# EAGLE schematic candy-avb (EAGLE 9.2.2)

## Sheet 1 of 4
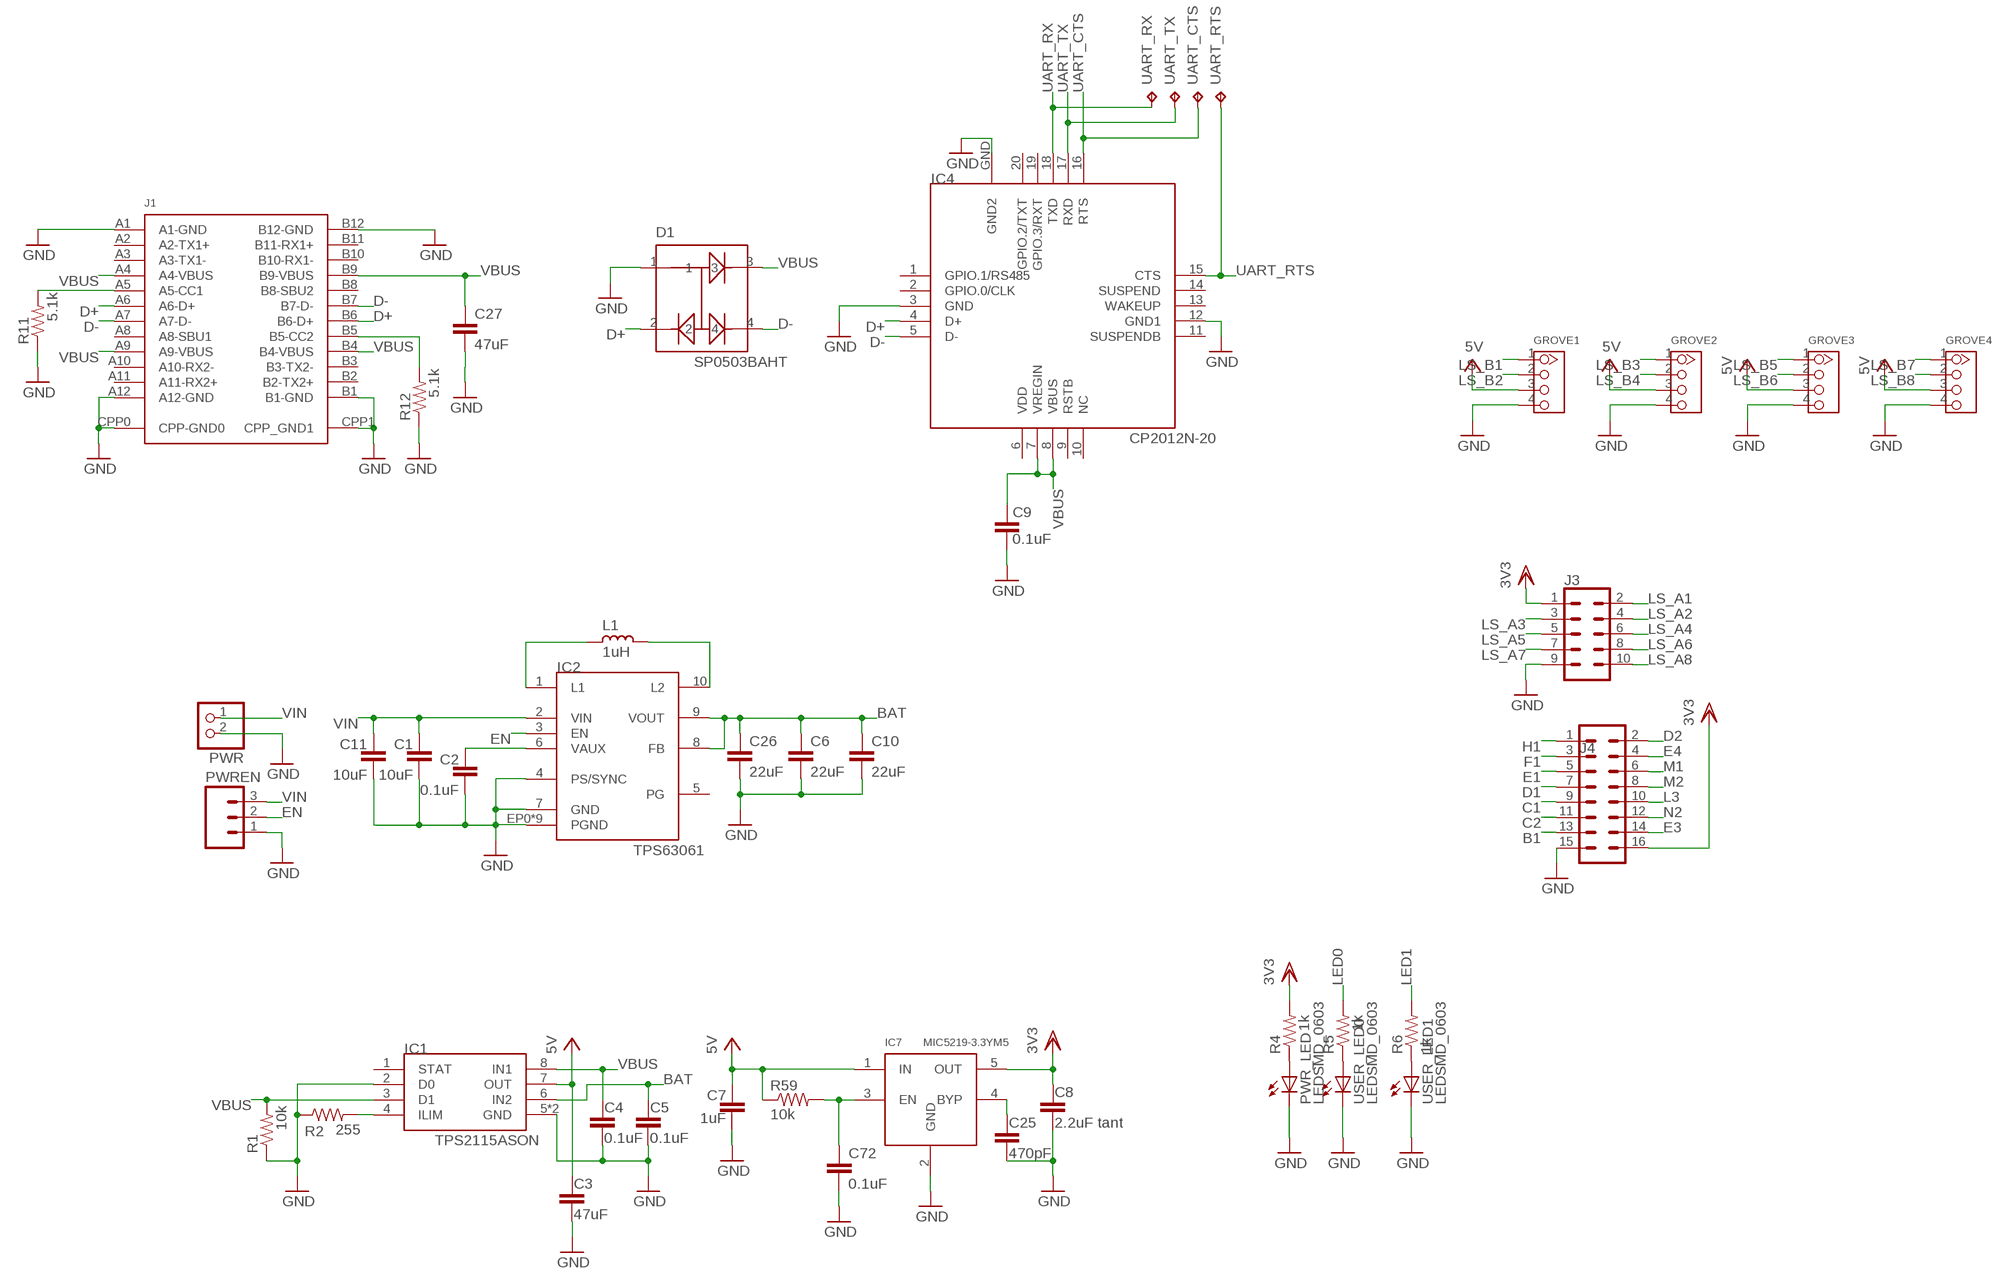
[diagram p0: schematic, sheet 1]

### Parts
C1  10uF  C-EUC0805  [C0805]
C2  0.1uF  C-EUC1608  [C1608]
C3  47uF  C-EUC1210  [C1210]
C4  0.1uF  C-EUC1608  [C1608]
C5  0.1uF  C-EUC1608  [C1608]
C6  22uF  C-EUC0805  [C0805]
C7  1uF  C-EUC1608  [C1608]
C8  2.2uF tant  C-EUC1608  [C1608]
C9  0.1uF  C-EUC1608  [C1608]
C10  22uF  C-EUC0805  [C0805]
C11  10uF  C-EUC0805  [C0805]
C25  470pF  C-EUC1608  [C1608]
C26  22uF  C-EUC0805  [C0805]
C27  47uF  C-EUC1210  [C1210]
C72  0.1uF  C-EUC1608  [C1608]
D1  SP0503BAHT  [SOT143]
GROVE1  4P-2.0  SEEED_GROVE_CONN_4PSMD  [SEEED_GROVE_4PIN_TH]
GROVE2  4P-2.0  SEEED_GROVE_CONN_4PSMD  [SEEED_GROVE_4PIN_TH]
GROVE3  4P-2.0  SEEED_GROVE_CONN_4PSMD  [SEEED_GROVE_4PIN_TH]
GROVE4  4P-2.0  SEEED_GROVE_CONN_4PSMD  [SEEED_GROVE_4PIN_TH]
IC1  TPS2115ASON  [SON8]
IC2  TPS63061  TPS6306X  [S-PDSO-N10]
IC4  CP2012N-20  [CP2102-QFN20]
IC7  MIC5219-3.3YM5  [SOT23-5]
J1  USB_TYPEC_WE_632723  [USB_TYPEC_WE_632723]
J3  CONN_05X2PTH  [2X5]
J4  2X6 FEMALE  CONN_08X2  [2X8]
L1  1uH  L_4240  [L4240]
PWR  JST_2PIN-THM  [JST-PH-2-THM]
PWR_LED  LEDSMD_0603  [CHIPLED_0603]
PWREN  M03PTH  [1X03]
R1  10k  RESISTOR0402-RES  [0402-RES]
R2  255  RESISTOR0402-RES  [0402-RES]
R4  1k  RESISTOR0402-RES  [0402-RES]
R5  1k  RESISTOR0402-RES  [0402-RES]
R6  1k  RESISTOR0402-RES  [0402-RES]
R11  5.1k  RESISTOR0402-RES  [0402-RES]
R12  5.1k  RESISTOR0402-RES  [0402-RES]
R59  10k  RESISTOR0402-RES  [0402-RES]
UART_CTS  TPB1,27  [B1,27]
UART_RTS  TPB1,27  [B1,27]
UART_RX  TPB1,27  [B1,27]
UART_TX  TPB1,27  [B1,27]
USER_LED0  LEDSMD_0603  [CHIPLED_0603]
USER_LED1  LEDSMD_0603  [CHIPLED_0603]

### Nets
B1: J4.13 ; also sheet 2
BAT: C5.1 C6.1 C10.1 C26.1 IC1.6(IN2) IC2.8(FB) IC2.9(VOUT)
C1: J4.9 ; also sheet 2
C2: J4.11 ; also sheet 2
D1: J4.7 ; also sheet 2
D2: J4.2 ; also sheet 2
D+: D1.2 IC4.4(D+) J1.A6(A6-D+) J1.B6(B6-D+)
D-: D1.4 IC4.5(D-) J1.A7(A7-D-) J1.B7(B7-D-)
E1: J4.5 ; also sheet 2
E3: J4.14 ; also sheet 2
E4: J4.4 ; also sheet 2
EN: IC2.3(EN) PWREN.2
EN1: C72.1 IC7.3(EN) R59.2
F1: J4.3 ; also sheet 2
GND: C1.2 C2.2 C3.2 C4.2 C5.2 C6.2 C7.2 C8.2 C9.2 C10.2 C11.2 C25.2 C26.2 C27.2 C72.2 D1.1 GROVE1.4 GROVE2.4 GROVE3.4 GROVE4.4 IC1.2(D0) IC1.5(GND) IC1.EP(GND) IC2.4(PS/SYNC) IC2.7(GND) IC2.EP0(PGND) IC2.EP1(PGND) IC2.EP2(PGND) IC2.EP3(PGND) IC2.EP4(PGND) IC2.EP5(PGND) IC2.EP6(PGND) IC2.EP7(PGND) IC2.EP8(PGND) IC4.3(GND) IC4.12(GND1) IC4.GND(GND2) IC7.2(GND) J1.A1(A1-GND) J1.A12(A12-GND) J1.B1(B1-GND) J1.B12(B12-GND) J1.CPP0(CPP-GND0) J1.CPP1(CPP_GND1) J3.9 J4.15 PWR.2 PWR_LED.C PWREN.1 R1.1 R2.1 R11.1 R12.1 USER_LED0.C USER_LED1.C ; also sheet 2,3,4
H1: J4.1 ; also sheet 2
L3: J4.10 ; also sheet 2
LED0: R5.2 ; also sheet 2
LED1: R6.2 ; also sheet 2
LS_A1: J3.2 ; also sheet 2
LS_A2: J3.4 ; also sheet 2
LS_A3: J3.3 ; also sheet 2
LS_A4: J3.6 ; also sheet 2
LS_A5: J3.5 ; also sheet 2
LS_A6: J3.8 ; also sheet 2
LS_A7: J3.7 ; also sheet 2
LS_A8: J3.10 ; also sheet 2
LS_B1: GROVE1.1 ; also sheet 2
LS_B2: GROVE1.2 ; also sheet 2
LS_B3: GROVE2.1 ; also sheet 2
LS_B4: GROVE2.2 ; also sheet 2
LS_B5: GROVE3.1 ; also sheet 2
LS_B6: GROVE3.2 ; also sheet 2
LS_B7: GROVE4.1 ; also sheet 2
LS_B8: GROVE4.2 ; also sheet 2
M1: J4.6 ; also sheet 2
M2: J4.8 ; also sheet 2
N2: J4.12 ; also sheet 2
N$1: C2.1 IC2.6(VAUX)
N$2: C25.1 IC7.4(BYP)
N$3: PWR_LED.A R4.1
N$4: J1.A5(A5-CC1) R11.2
N$5: IC2.1(L1) L1.2
N$6: IC2.10(L2) L1.1
N$7: J1.B5(B5-CC2) R12.2
N$9: R6.1 USER_LED1.A
N$19: R5.1 USER_LED0.A
N$61: IC1.4(ILIM) R2.2
UART_CTS: IC4.16(RTS) UART_CTS.TP ; also sheet 2
UART_RTS: IC4.15(CTS) UART_RTS.TP ; also sheet 2
UART_RX: IC4.18(TXD) UART_RX.TP ; also sheet 2
UART_TX: IC4.17(RXD) UART_TX.TP ; also sheet 2
VBUS: C4.1 C9.1 C27.1 D1.3 IC1.3(D1) IC1.8(IN1) IC4.7(VREGIN) IC4.8(VBUS) J1.A4(A4-VBUS) J1.A9(A9-VBUS) J1.B4(B4-VBUS) J1.B9(B9-VBUS) R1.2
VCC: C3.1 C7.1 GROVE1.3 GROVE2.3 GROVE3.3 GROVE4.3 IC1.7(OUT) IC7.1(IN) R59.1 ; supply symbol labelled 5V ; also sheet 2
VDD: C8.1 IC7.5(OUT) J3.1 J4.16 R4.2 ; supply symbol labelled 3V3 ; also sheet 2,3,4
VIN: C1.1 C11.1 IC2.2(VIN) PWR.1 PWREN.3
Unconnected: IC1.1(STAT) IC2.5(PG) IC4.1(GPIO.1/RS485) IC4.2(GPIO.0/CLK) IC4.9(RSTB) IC4.10(NC) IC4.11(SUSPENDB) IC4.13(WAKEUP) IC4.14(SUSPEND) IC4.19(GPIO.3/RXT) IC4.20(GPIO.2/TXT) J1.A2(A2-TX1+) J1.A3(A3-TX1-) J1.A8(A8-SBU1) J1.A10(A10-RX2-) J1.A11(A11-RX2+) J1.B2(B2-TX2+) J1.B3(B3-TX2-) J1.B8(B8-SBU2) J1.B10(B10-RX1-) J1.B11(B11-RX1+)

## Sheet 2 of 4: FPGA
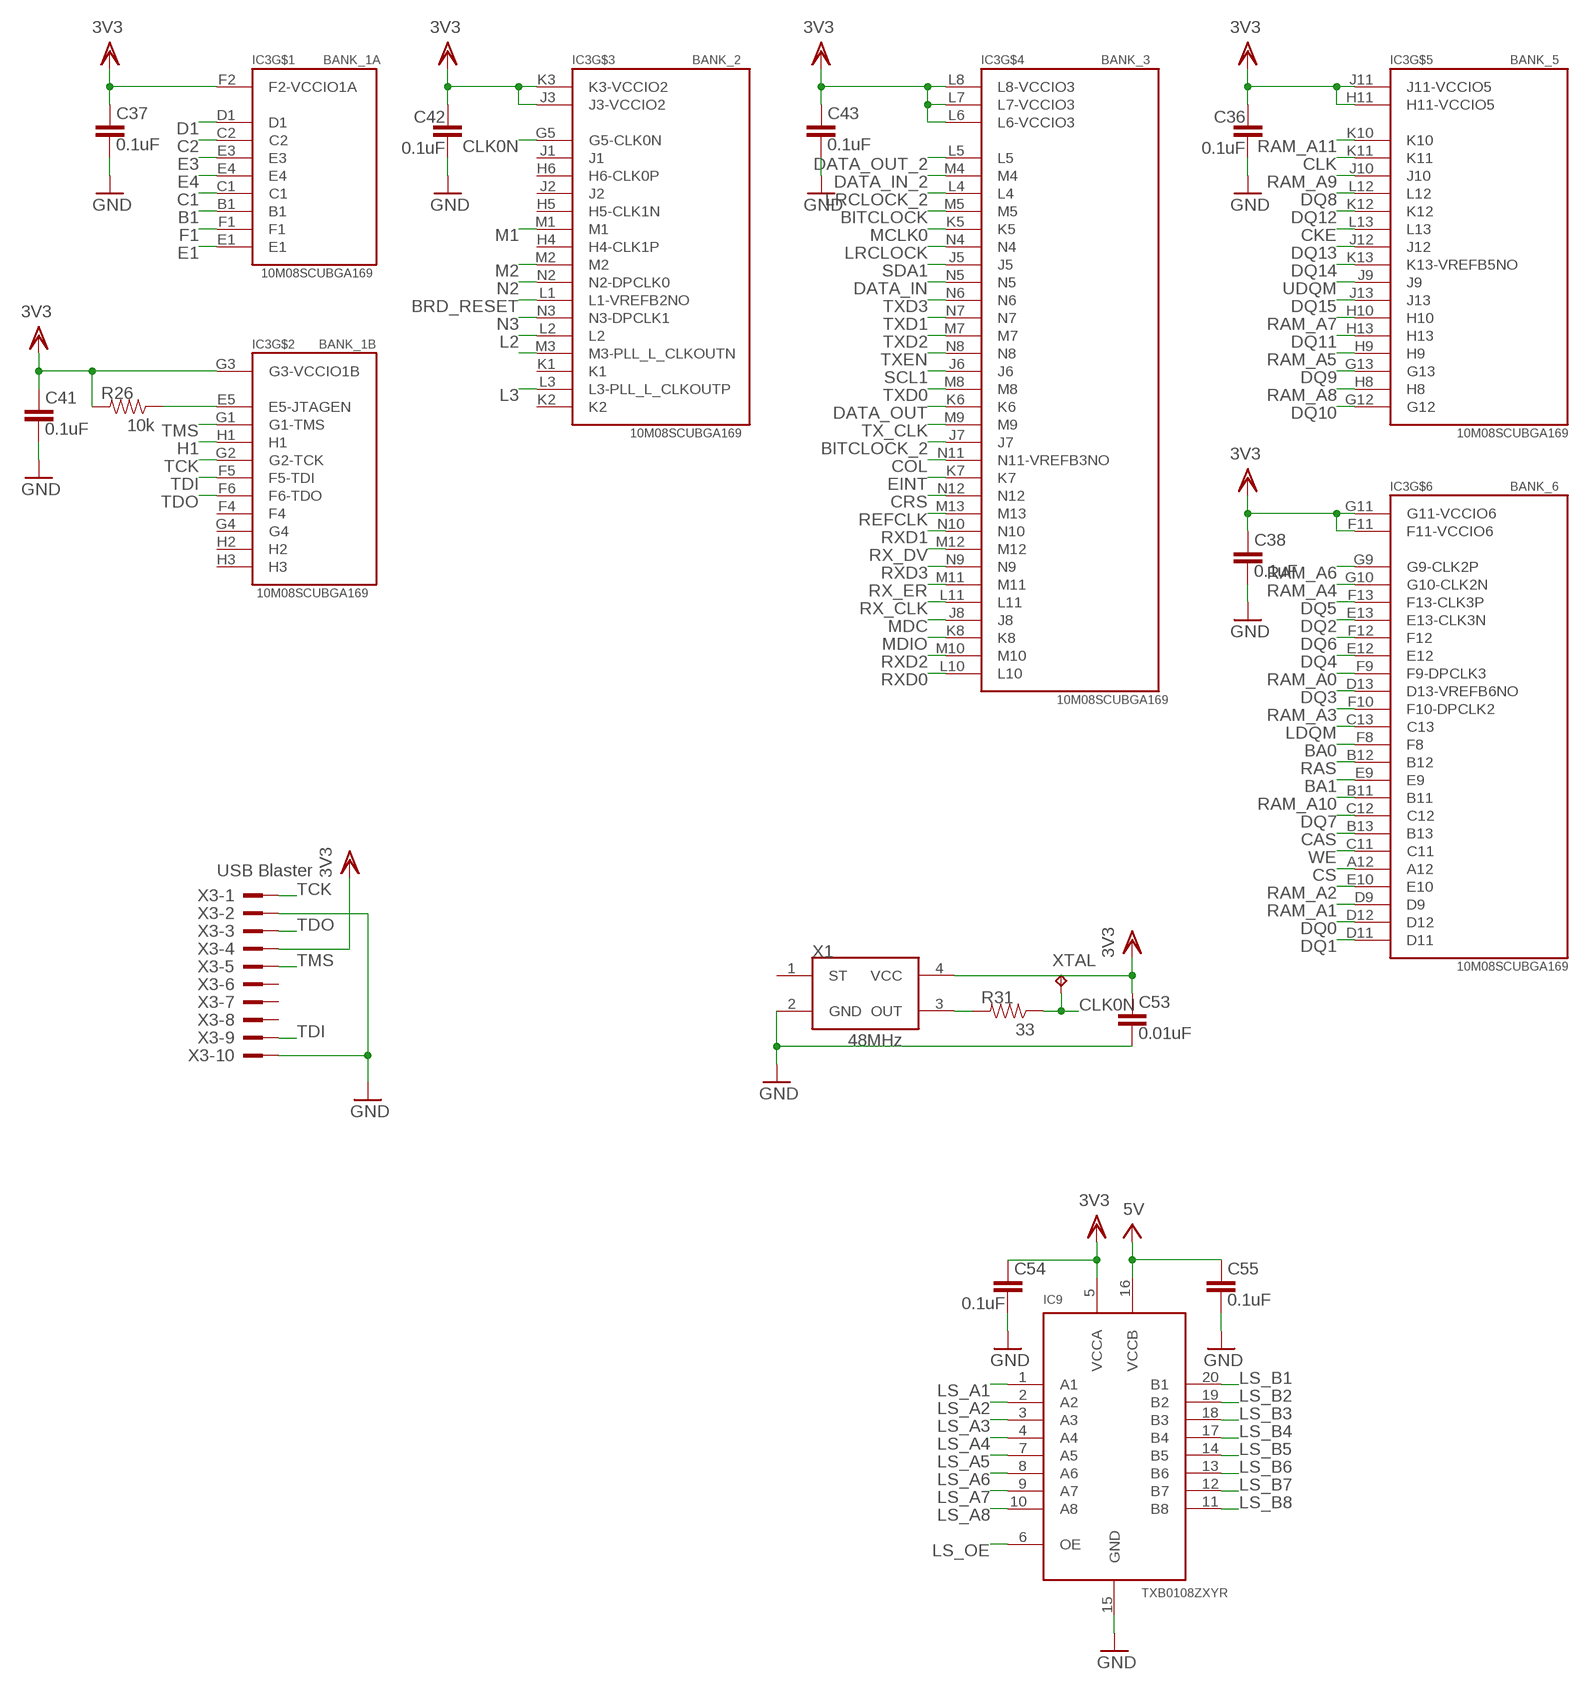
[diagram p1: schematic, sheet 2, part 1 of 2]
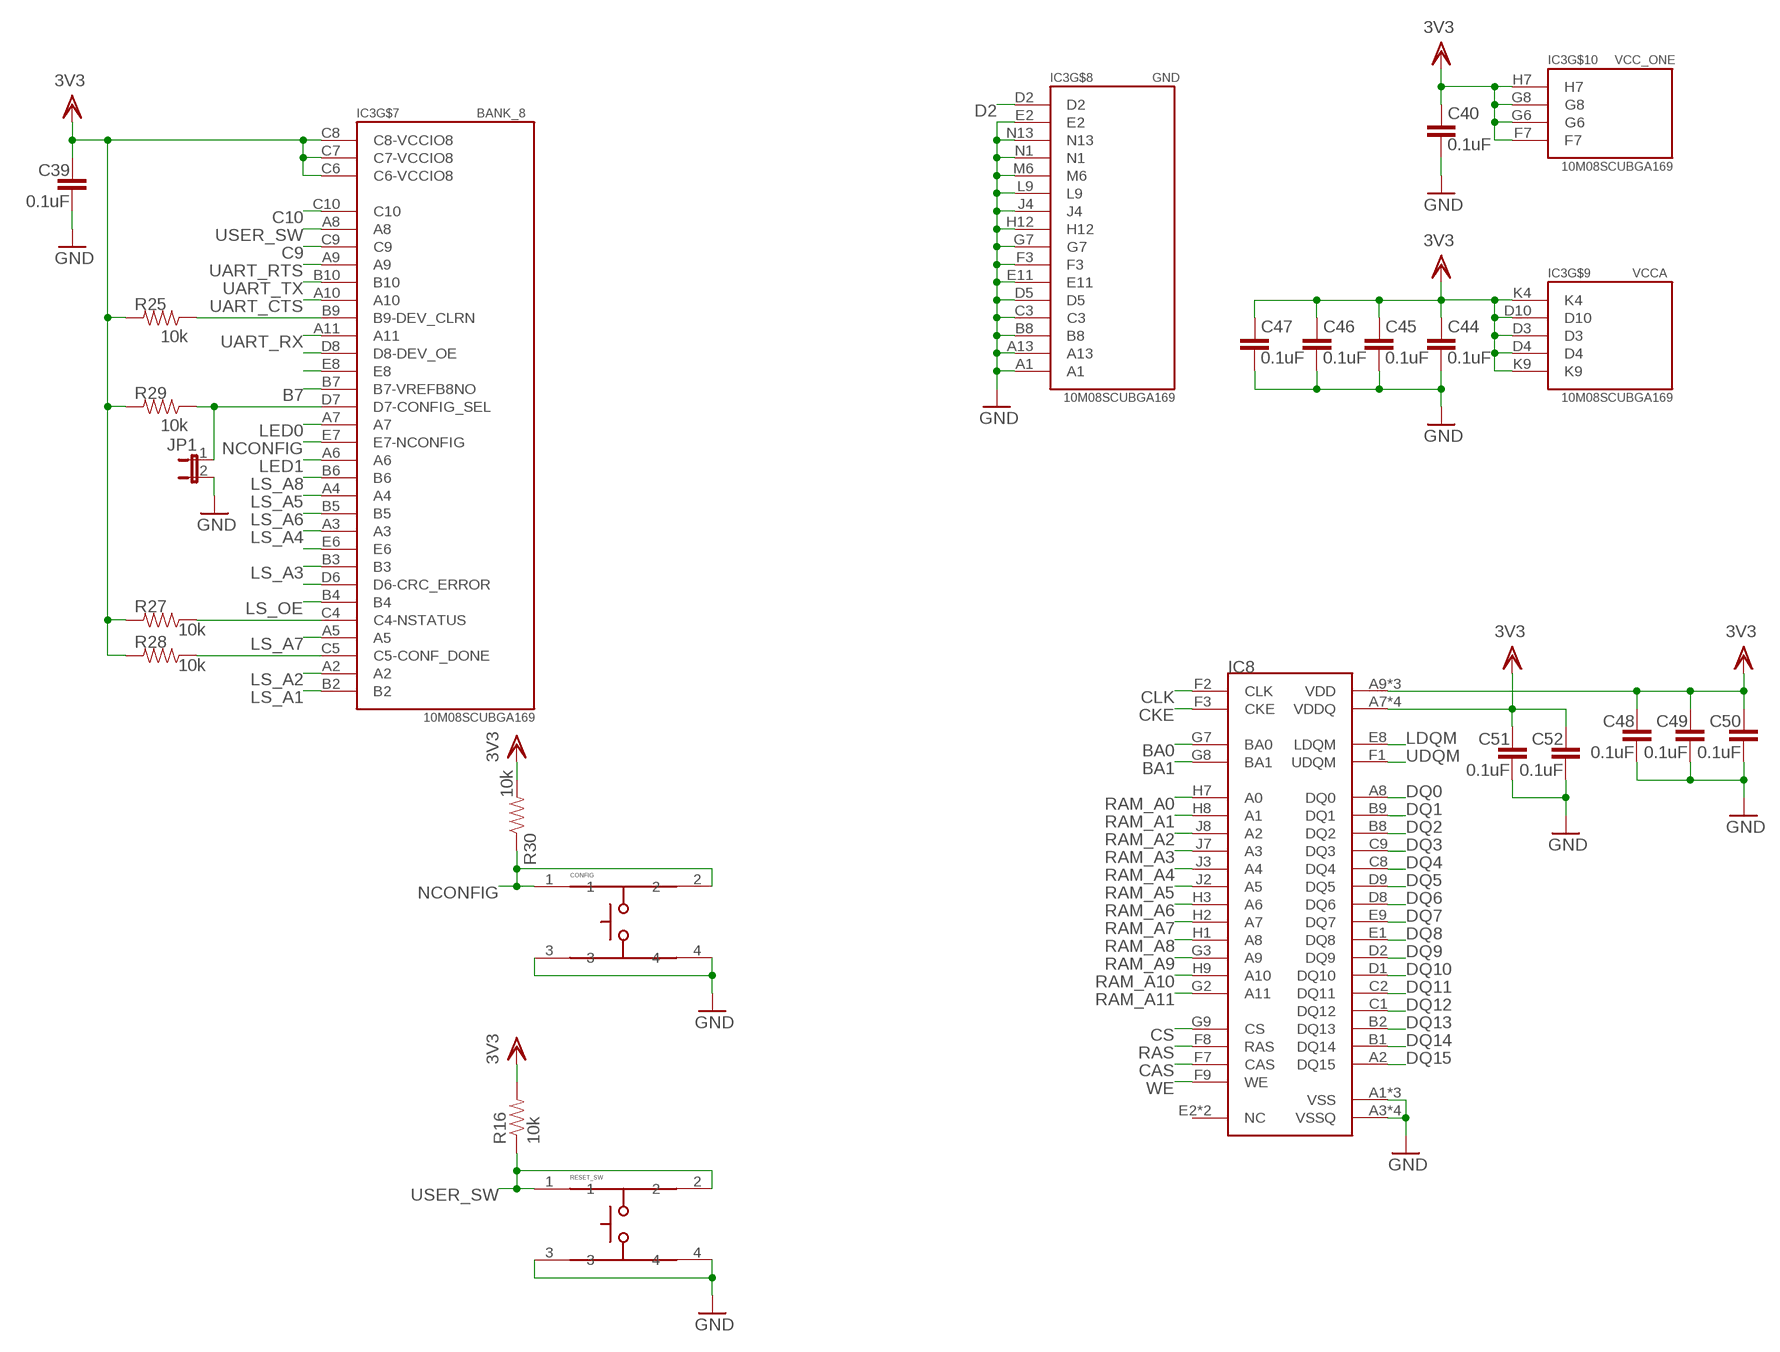
[diagram p2: schematic, sheet 2, part 2 of 2]

### Parts
C36  0.1uF  C-EUC0402  [C0402]
C37  0.1uF  C-EUC0402  [C0402]
C38  0.1uF  C-EUC0402  [C0402]
C39  0.1uF  C-EUC0402  [C0402]
C40  0.1uF  C-EUC0402  [C0402]
C41  0.1uF  C-EUC0402  [C0402]
C42  0.1uF  C-EUC0402  [C0402]
C43  0.1uF  C-EUC0402  [C0402]
C44  0.1uF  C-EUC0402  [C0402]
C45  0.1uF  C-EUC0402  [C0402]
C46  0.1uF  C-EUC0402  [C0402]
C47  0.1uF  C-EUC0402  [C0402]
C48  0.1uF  C-EUC0402  [C0402]
C49  0.1uF  C-EUC0402  [C0402]
C50  0.1uF  C-EUC0402  [C0402]
C51  0.1uF  C-EUC0402  [C0402]
C52  0.1uF  C-EUC0402  [C0402]
C53  0.01uF  C-EUC0402  [C0402]
C54  0.1uF  C-EUC0402  [C0402]
C55  0.1uF  C-EUC0402  [C0402]
CONFIG  TACTILE_SW_4PINSKRPABE010  [SKRPABE010]
IC3  10M08SCUBGA169  [MBGA169-MAX10]
IC8  AS4C4M16SAFBGA54  [FBGA54-AS4C4M16SA]
IC9  TXB0108ZXYR  TXB0108USON20  [USON20]
JP1  JUMPER-2SMD-NO  [SJ_2S-NO]
R16  10k  RESISTOR0402-RES  [0402-RES]
R25  10k  RESISTOR0402-RES  [0402-RES]
R26  10k  RESISTOR0402-RES  [0402-RES]
R27  10k  RESISTOR0402-RES  [0402-RES]
R28  10k  RESISTOR0402-RES  [0402-RES]
R29  10k  RESISTOR0402-RES  [0402-RES]
R30  10k  RESISTOR0402-RES  [0402-RES]
R31  33  RESISTOR0402-RES  [0402-RES]
RESET_SW  TACTILE_SW_4PINSKRPABE010  [SKRPABE010]
X1  48MHz  EPSON_SG310SMD_3225  [SMD3225_4_EPSON]
X3  USB Blaster  2510-  [PAK100/2500-10]
XTAL  TPPAD1-13  [P1-13]

### Nets
B1: IC3.B1 ; also sheet 1
B7: IC3.B7(B7-VREFB8NO)
BA0: IC3.F8 IC8.G7(BA0)
BA1: IC3.E9 IC8.G8(BA1)
BITCLOCK: IC3.M5 ; also sheet 4
BITCLOCK_2: IC3.J7 ; also sheet 4
BRD_RESET: IC3.L1(L1-VREFB2NO) ; also sheet 4
C1: IC3.C1 ; also sheet 1
C2: IC3.C2 ; also sheet 1
C9: IC3.C9
C10: IC3.C10
CAS: IC3.B13 IC8.F7(CAS)
CKE: IC3.L13 IC8.F3(CKE)
CLK: IC3.K11 IC8.F2(CLK)
CLK0N: IC3.G5(G5-CLK0N) R31.1 XTAL.TP
COL: IC3.N11(N11-VREFB3NO) ; also sheet 3
CRS: IC3.N12 ; also sheet 3
CS: IC3.A12 IC8.G9(CS)
D1: IC3.D1 ; also sheet 1
D2: IC3.D2 ; also sheet 1
DATA_IN: IC3.N5 ; also sheet 4
DATA_IN_2: IC3.M4 ; also sheet 4
DATA_OUT: IC3.K6 ; also sheet 4
DATA_OUT_2: IC3.L5 ; also sheet 4
DQ0: IC3.D12 IC8.A8(DQ0)
DQ1: IC3.D11 IC8.B9(DQ1)
DQ2: IC3.E13(E13-CLK3N) IC8.B8(DQ2)
DQ3: IC3.D13(D13-VREFB6NO) IC8.C9(DQ3)
DQ4: IC3.E12 IC8.C8(DQ4)
DQ5: IC3.F13(F13-CLK3P) IC8.D9(DQ5)
DQ6: IC3.F12 IC8.D8(DQ6)
DQ7: IC3.C12 IC8.E9(DQ7)
DQ8: IC3.L12 IC8.E1(DQ8)
DQ9: IC3.G13 IC8.D2(DQ9)
DQ10: IC3.G12 IC8.D1(DQ10)
DQ11: IC3.H13 IC8.C2(DQ11)
DQ12: IC3.K12 IC8.C1(DQ12)
DQ13: IC3.J12 IC8.B2(DQ13)
DQ14: IC3.K13(K13-VREFB5NO) IC8.B1(DQ14)
DQ15: IC3.J13 IC8.A2(DQ15)
E1: IC3.E1 ; also sheet 1
E3: IC3.E3 ; also sheet 1
E4: IC3.E4 ; also sheet 1
EINT: IC3.K7 ; also sheet 3
F1: IC3.F1 ; also sheet 1
GND: C36.2 C37.2 C38.2 C39.2 C40.2 C41.2 C42.2 C43.2 C44.2 C45.2 C46.2 C47.2 C48.2 C49.2 C50.2 C51.2 C52.2 C53.2 C54.2 C55.2 CONFIG.3 CONFIG.4 IC3.A1 IC3.A13 IC3.B8 IC3.C3 IC3.D5 IC3.E2 IC3.E11 IC3.F3 IC3.G7 IC3.H12 IC3.J4 IC3.L9 IC3.M6 IC3.N1 IC3.N13 IC8.A1(VSS) IC8.A3(VSSQ) IC8.B7(VSSQ) IC8.C3(VSSQ) IC8.D7(VSSQ) IC8.E3(VSS) IC8.J1(VSS) IC9.15(GND) JP1.2 RESET_SW.3 RESET_SW.4 X1.2(GND) X3.2 X3.10 ; also sheet 1,3,4
H1: IC3.H1 ; also sheet 1
L2: IC3.L2
L3: IC3.L3(L3-PLL_L_CLKOUTP) ; also sheet 1
LDQM: IC3.C13 IC8.E8(LDQM)
LED0: IC3.A7 ; also sheet 1
LED1: IC3.A6 ; also sheet 1
LRCLOCK: IC3.N4 ; also sheet 4
LRCLOCK_2: IC3.L4 ; also sheet 4
LS_A1: IC3.B2 IC9.1(A1) ; also sheet 1
LS_A2: IC3.A2 IC9.2(A2) ; also sheet 1
LS_A3: IC3.B3 IC9.3(A3) ; also sheet 1
LS_A4: IC3.A3 IC9.4(A4) ; also sheet 1
LS_A5: IC3.A4 IC9.7(A5) ; also sheet 1
LS_A6: IC3.B5 IC9.8(A6) ; also sheet 1
LS_A7: IC3.A5 IC9.9(A7) ; also sheet 1
LS_A8: IC3.B6 IC9.10(A8) ; also sheet 1
LS_B1: IC9.20(B1) ; also sheet 1
LS_B2: IC9.19(B2) ; also sheet 1
LS_B3: IC9.18(B3) ; also sheet 1
LS_B4: IC9.17(B4) ; also sheet 1
LS_B5: IC9.14(B5) ; also sheet 1
LS_B6: IC9.13(B6) ; also sheet 1
LS_B7: IC9.12(B7) ; also sheet 1
LS_B8: IC9.11(B8) ; also sheet 1
LS_OE: IC3.B4 IC9.6(OE)
M1: IC3.M1 ; also sheet 1
M2: IC3.M2 ; also sheet 1
MCLK0: IC3.K5 ; also sheet 4
MDC: IC3.J8 ; also sheet 3
MDIO: IC3.K8 ; also sheet 3
N2: IC3.N2(N2-DPCLK0) ; also sheet 1
N3: IC3.N3(N3-DPCLK1)
N$23: IC3.E5(E5-JTAGEN) R26.1
N$24: IC3.B9(B9-DEV_CLRN) R25.1
N$25: IC3.C4(C4-NSTATUS) R27.1
N$26: IC3.C5(C5-CONF_DONE) R28.1
N$27: IC3.D7(D7-CONFIG_SEL) JP1.1 R29.1
N$48: R31.2 X1.3(OUT)
N$104: IC3.D8(D8-DEV_OE)
N$105: IC3.E8
N$113: IC3.E6
N$115: IC3.D6(D6-CRC_ERROR)
N$132: IC3.M3(M3-PLL_L_CLKOUTN)
NCONFIG: CONFIG.1 CONFIG.2 IC3.E7(E7-NCONFIG) R30.1
RAM_A0: IC3.F9(F9-DPCLK3) IC8.H7(A0)
RAM_A1: IC3.D9 IC8.H8(A1)
RAM_A2: IC3.E10 IC8.J8(A2)
RAM_A3: IC3.F10(F10-DPCLK2) IC8.J7(A3)
RAM_A4: IC3.G10(G10-CLK2N) IC8.J3(A4)
RAM_A5: IC3.H9 IC8.J2(A5)
RAM_A6: IC3.G9(G9-CLK2P) IC8.H3(A6)
RAM_A7: IC3.H10 IC8.H2(A7)
RAM_A8: IC3.H8 IC8.H1(A8)
RAM_A9: IC3.J10 IC8.G3(A9)
RAM_A10: IC3.B11 IC8.H9(A10)
RAM_A11: IC3.K10 IC8.G2(A11)
RAS: IC3.B12 IC8.F8(RAS)
REFCLK: IC3.M13 ; also sheet 3
RX_CLK: IC3.L11 ; also sheet 3
RX_DV: IC3.M12 ; also sheet 3
RX_ER: IC3.M11 ; also sheet 3
RXD0: IC3.L10 ; also sheet 3
RXD1: IC3.N10 ; also sheet 3
RXD2: IC3.M10 ; also sheet 3
RXD3: IC3.N9 ; also sheet 3
SCL1: IC3.J6 ; also sheet 4
SDA1: IC3.J5 ; also sheet 4
TCK: IC3.G2(G2-TCK) X3.1
TDI: IC3.F5(F5-TDI) X3.9
TDO: IC3.F6(F6-TDO) X3.3
TMS: IC3.G1(G1-TMS) X3.5
TX_CLK: IC3.M9 ; also sheet 3
TXD0: IC3.M8 ; also sheet 3
TXD1: IC3.N7 ; also sheet 3
TXD2: IC3.M7 ; also sheet 3
TXD3: IC3.N6 ; also sheet 3
TXEN: IC3.N8 ; also sheet 3
UART_CTS: IC3.A10 ; also sheet 1
UART_RTS: IC3.A9 ; also sheet 1
UART_RX: IC3.A11 ; also sheet 1
UART_TX: IC3.B10 ; also sheet 1
UDQM: IC3.J9 IC8.F1(UDQM)
USER_SW: IC3.A8 R16.1 RESET_SW.1 RESET_SW.2
VCC: C55.1 IC9.16(VCCB) ; supply symbol labelled 5V ; also sheet 1
VDD: C36.1 C37.1 C38.1 C39.1 C40.1 C41.1 C42.1 C43.1 C44.1 C45.1 C46.1 C47.1 C48.1 C49.1 C50.1 C51.1 C52.1 C53.1 C54.1 IC3.C6(C6-VCCIO8) IC3.C7(C7-VCCIO8) IC3.C8(C8-VCCIO8) IC3.D3 IC3.D4 IC3.D10 IC3.F2(F2-VCCIO1A) IC3.F7 IC3.F11(F11-VCCIO6) IC3.G3(G3-VCCIO1B) IC3.G6 IC3.G8 IC3.G11(G11-VCCIO6) IC3.H7 IC3.H11(H11-VCCIO5) IC3.J3(J3-VCCIO2) IC3.J11(J11-VCCIO5) IC3.K3(K3-VCCIO2) IC3.K4 IC3.K9 IC3.L6(L6-VCCIO3) IC3.L7(L7-VCCIO3) IC3.L8(L8-VCCIO3) IC8.A7(VDDQ) IC8.A9(VDD) IC8.B3(VDDQ) IC8.C7(VDDQ) IC8.D3(VDDQ) IC8.E7(VDD) IC8.J9(VDD) IC9.5(VCCA) R16.2 R25.2 R26.2 R27.2 R28.2 R29.2 R30.2 X1.4(VCC) X3.4 ; supply symbol labelled 3V3 ; also sheet 1,3,4
WE: IC3.C11 IC8.F9(WE)
Unconnected: IC3.F4 IC3.G4 IC3.H2 IC3.H3 IC3.H4(H4-CLK1P) IC3.H5(H5-CLK1N) IC3.H6(H6-CLK0P) IC3.J1 IC3.J2 IC3.K1 IC3.K2 IC8.E2(NC) IC8.G1(NC) X1.1(ST) X3.6 X3.7 X3.8

## Sheet 3 of 4: ETHERNET
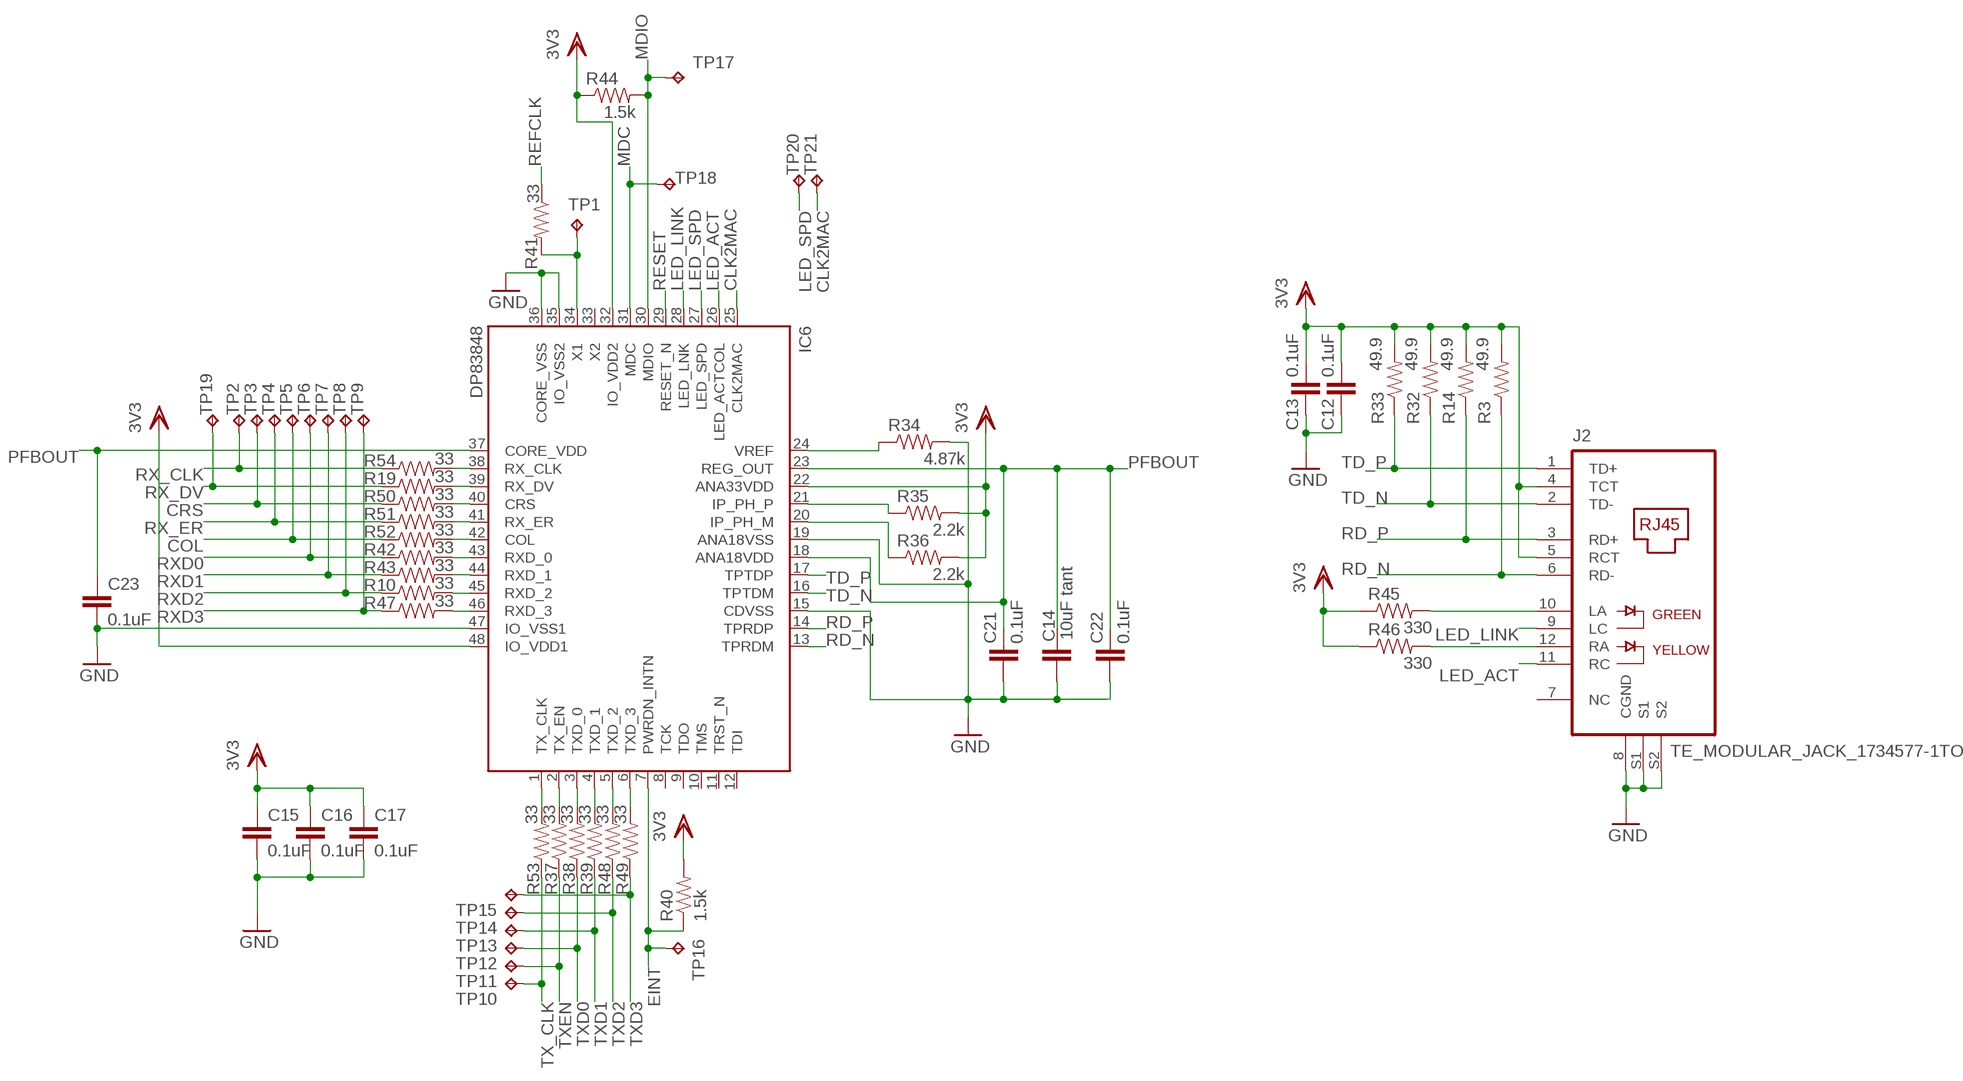
[diagram p3: schematic, sheet 3]

### Parts
C12  0.1uF  C-EUC0402  [C0402]
C13  0.1uF  C-EUC0402  [C0402]
C14  10uF tant  C-EUC0603  [C0603]
C15  0.1uF  C-EUC0402  [C0402]
C16  0.1uF  C-EUC0402  [C0402]
C17  0.1uF  C-EUC0402  [C0402]
C21  0.1uF  C-EUC0402  [C0402]
C22  0.1uF  C-EUC0402  [C0402]
C23  0.1uF  C-EUC0402  [C0402]
IC6  DP83848  [LQFP48]
J2  TE_MODULAR_JACK_1734577-1TOP  [TE_MODULAR_JACK_1734577-1]
R3  49.9  RESISTOR0402-RES  [0402-RES]
R10  33  RESISTOR0402-RES  [0402-RES]
R14  49.9  RESISTOR0402-RES  [0402-RES]
R19  33  RESISTOR0402-RES  [0402-RES]
R32  49.9  RESISTOR0402-RES  [0402-RES]
R33  49.9  RESISTOR0402-RES  [0402-RES]
R34  4.87k  RESISTOR0402-RES  [0402-RES]
R35  2.2k  RESISTOR0402-RES  [0402-RES]
R36  2.2k  RESISTOR0402-RES  [0402-RES]
R37  33  RESISTOR0402-RES  [0402-RES]
R38  33  RESISTOR0402-RES  [0402-RES]
R39  33  RESISTOR0402-RES  [0402-RES]
R40  1.5k  RESISTOR0402-RES  [0402-RES]
R41  33  RESISTOR0402-RES  [0402-RES]
R42  33  RESISTOR0402-RES  [0402-RES]
R43  33  RESISTOR0402-RES  [0402-RES]
R44  1.5k  RESISTOR0402-RES  [0402-RES]
R45  330  RESISTOR0402-RES  [0402-RES]
R46  330  RESISTOR0402-RES  [0402-RES]
R47  33  RESISTOR0402-RES  [0402-RES]
R48  33  RESISTOR0402-RES  [0402-RES]
R49  33  RESISTOR0402-RES  [0402-RES]
R50  33  RESISTOR0402-RES  [0402-RES]
R51  33  RESISTOR0402-RES  [0402-RES]
R52  33  RESISTOR0402-RES  [0402-RES]
R53  33  RESISTOR0402-RES  [0402-RES]
R54  33  RESISTOR0402-RES  [0402-RES]
TP1  TPPAD1-13  [P1-13]
TP2  TPB1,27  [B1,27]
TP3  TPB1,27  [B1,27]
TP4  TPB1,27  [B1,27]
TP5  TPB1,27  [B1,27]
TP6  TPB1,27  [B1,27]
TP7  TPB1,27  [B1,27]
TP8  TPB1,27  [B1,27]
TP9  TPB1,27  [B1,27]
TP10  TPB1,27  [B1,27]
TP11  TPB1,27  [B1,27]
TP12  TPB1,27  [B1,27]
TP13  TPB1,27  [B1,27]
TP14  TPB1,27  [B1,27]
TP15  TPB1,27  [B1,27]
TP16  TPB1,27  [B1,27]
TP17  TPB1,27  [B1,27]
TP18  TPB1,27  [B1,27]
TP19  TPB1,27  [B1,27]
TP20  TPB1,27  [B1,27]
TP21  TPB1,27  [B1,27]

### Nets
CLK2MAC: IC6.25(CLK2MAC) TP21.TP
COL: R52.1 TP5.TP ; also sheet 2
CRS: R50.1 TP3.TP ; also sheet 2
EINT: IC6.7(PWRDN_INTN) R40.1 TP16.TP ; also sheet 2
GND: C12.2 C13.2 C14.2 C15.2 C16.2 C17.2 C21.2 C22.2 C23.2 IC6.15(CDVSS) IC6.19(ANA18VSS) IC6.35(IO_VSS2) IC6.36(CORE_VSS) IC6.47(IO_VSS1) J2.8(CGND) J2.S1 J2.S2 R34.2 ; also sheet 1,2,4
LED_ACT: IC6.26(LED_ACTCOL) J2.11(RC)
LED_LINK: IC6.28(LED_LNK) J2.9(LC)
LED_SPD: IC6.27(LED_SPD) TP20.TP
MDC: IC6.31(MDC) TP18.TP ; also sheet 2
MDIO: IC6.30(MDIO) R44.2 TP17.TP ; also sheet 2
N$12: IC6.20(IP_PH_M) R36.1
N$21: IC6.39(RX_DV) R19.2
N$22: IC6.4(TXD_1) R39.2
N$50: IC6.45(RXD_2) R10.2
N$53: IC6.46(RXD_3) R47.2
N$57: IC6.3(TXD_0) R38.2
N$58: IC6.2(TX_EN) R37.2
N$59: IC6.34(X1) R41.2 TP1.TP
N$60: IC6.43(RXD_0) R42.2
N$62: IC6.5(TXD_2) R48.2
N$63: J2.10(LA) R45.2
N$64: J2.12(RA) R46.2
N$65: IC6.44(RXD_1) R43.2
N$66: IC6.21(IP_PH_P) R35.1
N$67: IC6.24(VREF) R34.1
N$68: IC6.6(TXD_3) R49.2
N$69: IC6.42(COL) R52.2
N$70: IC6.41(RX_ER) R51.2
N$71: IC6.40(CRS) R50.2
N$72: IC6.38(RX_CLK) R54.2
PFBOUT: C14.1 C21.1 C22.1 C23.1 IC6.18(ANA18VDD) IC6.23(REG_OUT) IC6.37(CORE_VDD)
RD_N: IC6.13(TPRDM) J2.6(RD-) R3.1
RD_P: IC6.14(TPRDP) J2.3(RD+) R14.1
REFCLK: R41.1 ; also sheet 2
RESET: IC6.29(RESET_N)
RX_CLK: R54.1 TP2.TP ; also sheet 2
RX_DV: R19.1 TP19.TP ; also sheet 2
RX_ER: R51.1 TP4.TP ; also sheet 2
RXD0: R42.1 TP6.TP ; also sheet 2
RXD1: R43.1 TP7.TP ; also sheet 2
RXD2: R10.1 TP8.TP ; also sheet 2
RXD3: R47.1 TP9.TP ; also sheet 2
TD_N: IC6.16(TPTDM) J2.2(TD-) R32.1
TD_P: IC6.17(TPTDP) J2.1(TD+) R33.1
TX_CLK: R53.1 TP10.TP ; also sheet 2
TXCLK: IC6.1(TX_CLK) R53.2
TXD0: R38.1 TP12.TP ; also sheet 2
TXD1: R39.1 TP13.TP ; also sheet 2
TXD2: R48.1 TP14.TP ; also sheet 2
TXD3: R49.1 TP15.TP ; also sheet 2
TXEN: R37.1 TP11.TP ; also sheet 2
VDD: C12.1 C13.1 C15.1 C16.1 C17.1 IC6.22(ANA33VDD) IC6.32(IO_VDD2) IC6.48(IO_VDD1) J2.4(TCT) J2.5(RCT) R3.2 R14.2 R32.2 R33.2 R35.2 R36.2 R40.2 R44.1 R45.1 R46.1 ; supply symbol labelled 3V3 ; also sheet 1,2,4
Unconnected: IC6.8(TCK) IC6.9(TDO) IC6.10(TMS) IC6.11(TRST_N) IC6.12(TDI) IC6.33(X2) J2.7(NC)

## Sheet 4 of 4: DSP
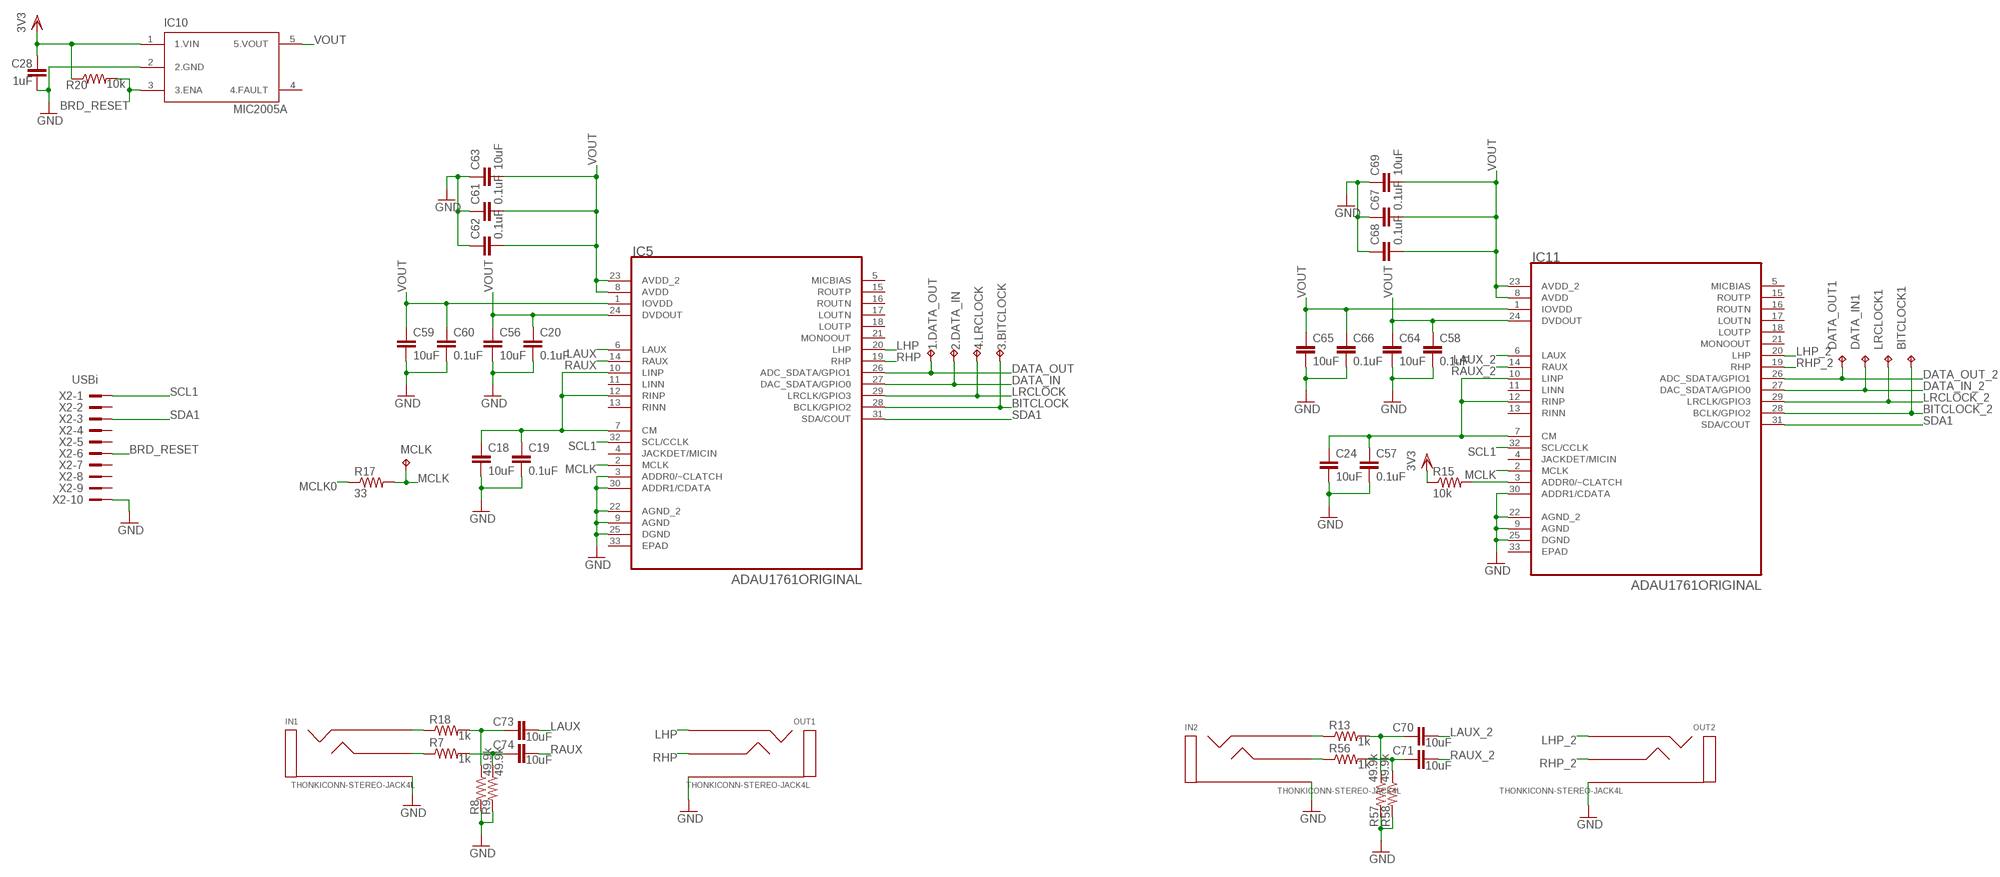
[diagram p4: schematic, sheet 4]

### Parts
1.DATA_OUT  TPB1,27  [B1,27]
2.DATA_IN  TPB1,27  [B1,27]
3.BITCLOCK  TPB1,27  [B1,27]
4.LRCLOCK  TPB1,27  [B1,27]
BITCLOCK1  TPB1,27  [B1,27]
C18  10uF  C-EUC0603  [C0603]
C19  0.1uF  C-EUC0402  [C0402]
C20  0.1uF  C-EUC0402  [C0402]
C24  10uF  C-EUC0603  [C0603]
C28  1uF  C-EUC0603  [C0603]
C56  10uF  C-EUC0603  [C0603]
C57  0.1uF  C-EUC0402  [C0402]
C58  0.1uF  C-EUC0402  [C0402]
C59  10uF  C-EUC0603  [C0603]
C60  0.1uF  C-EUC0402  [C0402]
C61  0.1uF  C-EUC0402  [C0402]
C62  0.1uF  C-EUC0402  [C0402]
C63  10uF  C-EUC0603  [C0603]
C64  10uF  C-EUC0603  [C0603]
C65  10uF  C-EUC0603  [C0603]
C66  0.1uF  C-EUC0402  [C0402]
C67  0.1uF  C-EUC0402  [C0402]
C68  0.1uF  C-EUC0402  [C0402]
C69  10uF  C-EUC0603  [C0603]
C70  10uF  C-EUC1608  [C1608]
C71  10uF  C-EUC1608  [C1608]
C73  10uF  C-EUC1608  [C1608]
C74  10uF  C-EUC1608  [C1608]
DATA_IN1  TPB1,27  [B1,27]
DATA_OUT1  TPB1,27  [B1,27]
IC5  ADAU1761ORIGINAL  [QFN50_500X500_33_O]
IC10  MIC2005A  MIC20XXSOT23-5  [SOT23-5]
IC11  ADAU1761ORIGINAL  [QFN50_500X500_33_O]
IN1  THONKICONN-STEREO-JACK4L  [THONKICONN-JACK-4]
IN2  THONKICONN-STEREO-JACK4L  [THONKICONN-JACK-4]
LRCLOCK1  TPB1,27  [B1,27]
MCLK  TPPAD1-13  [P1-13]
OUT1  THONKICONN-STEREO-JACK4L  [THONKICONN-JACK-4]
OUT2  THONKICONN-STEREO-JACK4L  [THONKICONN-JACK-4]
R7  1k  RESISTOR0402-RES  [0402-RES]
R8  49.9k  RESISTOR0402-RES  [0402-RES]
R9  49.9k  RESISTOR0402-RES  [0402-RES]
R13  1k  RESISTOR0402-RES  [0402-RES]
R15  10k  RESISTOR0402-RES  [0402-RES]
R17  33  RESISTOR0402-RES  [0402-RES]
R18  1k  RESISTOR0402-RES  [0402-RES]
R20  10k  RESISTOR0402-RES  [0402-RES]
R56  1k  RESISTOR0402-RES  [0402-RES]
R57  49.9k  RESISTOR0402-RES  [0402-RES]
R58  49.9k  RESISTOR0402-RES  [0402-RES]
X2  USBi  2510-  [PAK100/2500-10]

### Nets
BITCLOCK: 3.BITCLOCK.TP IC5.28(BCLK/GPIO2) ; also sheet 2
BITCLOCK_2: BITCLOCK1.TP IC11.28(BCLK/GPIO2) ; also sheet 2
BRD_RESET: IC10.3(3.ENA) R20.2 X2.6 ; also sheet 2
DATA_IN: 2.DATA_IN.TP IC5.27(DAC_SDATA/GPIO0) ; also sheet 2
DATA_IN_2: DATA_IN1.TP IC11.27(DAC_SDATA/GPIO0) ; also sheet 2
DATA_OUT: 1.DATA_OUT.TP IC5.26(ADC_SDATA/GPIO1) ; also sheet 2
DATA_OUT_2: DATA_OUT1.TP IC11.26(ADC_SDATA/GPIO1) ; also sheet 2
GND: C18.2 C19.2 C20.2 C24.2 C28.2 C56.2 C57.2 C58.2 C59.2 C60.2 C61.1 C62.1 C63.1 C64.2 C65.2 C66.2 C67.1 C68.1 C69.1 IC5.3(ADDR0/~CLATCH) IC5.9(AGND) IC5.22(AGND_2) IC5.25(DGND) IC5.30(ADDR1/CDATA) IC10.2(2.GND) IC11.9(AGND) IC11.22(AGND_2) IC11.25(DGND) IC11.30(ADDR1/CDATA) IN1.1B(1.SLEEVE) IN1.1T(1.SLEEVE) IN2.1B(1.SLEEVE) IN2.1T(1.SLEEVE) OUT1.1B(1.SLEEVE) OUT1.1T(1.SLEEVE) OUT2.1B(1.SLEEVE) OUT2.1T(1.SLEEVE) R8.2 R9.2 R57.2 R58.2 X2.10 ; also sheet 1,2,3
LAUX: C73.2 IC5.6(LAUX)
LAUX_2: C70.2 IC11.6(LAUX)
LHP: IC5.20(LHP) OUT1.3B(3.RING) OUT1.3T(3.RING)
LHP_2: IC11.20(LHP) OUT2.3B(3.RING) OUT2.3T(3.RING)
LRCLOCK: 4.LRCLOCK.TP IC5.29(LRCLK/GPIO3) ; also sheet 2
LRCLOCK_2: IC11.29(LRCLK/GPIO3) LRCLOCK1.TP ; also sheet 2
MCLK: IC5.2(MCLK) IC11.2(MCLK) MCLK.TP R17.2
MCLK0: R17.1 ; also sheet 2
N$8: IC11.3(ADDR0/~CLATCH) R15.2
N$28: C18.1 C19.1 IC5.7(CM) IC5.10(LINP) IC5.12(RINP)
N$29: IN1.3B(3.RING) IN1.3T(3.RING) R18.1
N$31: IN1.2B(2.TIP) IN1.2T(2.TIP) R7.1
N$32: C24.1 C57.1 IC11.7(CM) IC11.10(LINP) IC11.12(RINP)
N$33: C70.1 R13.2 R57.1
N$34: C71.1 R56.2 R58.1
N$35: IN2.3B(3.RING) IN2.3T(3.RING) R13.1
N$36: IN2.2B(2.TIP) IN2.2T(2.TIP) R56.1
N$37: C73.1 R8.1 R18.2
N$38: C74.1 R7.2 R9.1
RAUX: C74.2 IC5.14(RAUX)
RAUX_2: C71.2 IC11.14(RAUX)
RHP: IC5.19(RHP) OUT1.2B(2.TIP) OUT1.2T(2.TIP)
RHP_2: IC11.19(RHP) OUT2.2B(2.TIP) OUT2.2T(2.TIP)
SCL1: IC5.32(SCL/CCLK) IC11.32(SCL/CCLK) X2.1 ; also sheet 2
SDA1: IC5.31(SDA/COUT) IC11.31(SDA/COUT) X2.3 ; also sheet 2
VDD: C28.1 IC10.1(1.VIN) R15.1 R20.1 ; supply symbol labelled 3V3 ; also sheet 1,2,3
VOUT: C20.1 C56.1 C58.1 C59.1 C60.1 C61.2 C62.2 C63.2 C64.1 C65.1 C66.1 C67.2 C68.2 C69.2 IC5.1(IOVDD) IC5.8(AVDD) IC5.23(AVDD_2) IC5.24(DVDOUT) IC10.5(5.VOUT) IC11.1(IOVDD) IC11.8(AVDD) IC11.23(AVDD_2) IC11.24(DVDOUT)
Unconnected: IC5.4(JACKDET/MICIN) IC5.5(MICBIAS) IC5.11(LINN) IC5.13(RINN) IC5.15(ROUTP) IC5.16(ROUTN) IC5.17(LOUTN) IC5.18(LOUTP) IC5.21(MONOOUT) IC5.33(EPAD) IC10.4(4.FAULT) IC11.4(JACKDET/MICIN) IC11.5(MICBIAS) IC11.11(LINN) IC11.13(RINN) IC11.15(ROUTP) IC11.16(ROUTN) IC11.17(LOUTN) IC11.18(LOUTP) IC11.21(MONOOUT) IC11.33(EPAD) X2.2 X2.4 X2.5 X2.7 X2.8 X2.9

## Power pins joined to a net without a drawn wire
VDD: IC4.6(VDD)

## Library data of the parts
1.DATA_OUT 2.DATA_IN 3.BITCLOCK 4.LRCLOCK BITCLOCK1 DATA_IN1 DATA_OUT1 LRCLOCK1 MCLK TP1-TP21 UART_CTS UART_RTS UART_RX UART_TX XTAL = testpad:TP: Test pad
C1-C28 C36-C74 = tkrworks:C-EU: CAPACITOR, European symbol
CONFIG RESET_SW = tkrworks:TACTILE_SW_4PIN
D1 = tkrworks:SP0503BAHT
GROVE1-GROVE4 = tkrworks:SEEED_GROVE_CONN_4P
IC1 = tkrworks:TPS2115A
IC2 = tkrworks:TPS6306X
IC3 = tkrworks:10M08SC
IC4 = tkrworks:CP2012N-20
IC5 IC11 = tkrworks:ADAU1761
IC6 = national-semiconductor:DP83848: PHYTER® - Extended Temperature Single Port 10/100 Mb/s Ethernet Physical Layer Transceiver Auto generated by make-symbol-device-package-bsdl.ulp Rev. 34 Source: dp83848yb.bsdl http://www.national.com/ds/DP/DP83848VYB.pdf; MPN: DP83848VYB; OC_FARNELL: 1286817; OC_NEWARK: 11N4484
IC7 = tkrworks:MIC5219-3.3YM5
IC8 = tkrworks:AS4C4M16SA
IC9 = tkrworks:TXB0108
IC10 = tkrworks:MIC20XX
IN1 IN2 OUT1 OUT2 = tkrworks:THONKICONN-STEREO-JACK
J1 = tkrworks:USB_TYPEC_WE_632723
J2 = tkrworks:TE_MODULAR_JACK_1734577-1
J3 = SparkFun-Connectors:CONN_05X2: Multi connection point. Often used as Generic Header-pin footprint for 0.1 inch spaced/style header connections For AVR SPI programming port, see special device with nice symbol: "AVR_SPI_PROG_5x2.dev" You can populate with any combo of single row headers, but if you'd like an exact match, check these: 2x5 AVR ICSP Male Header <https://www.sparkfun.com/products/778> (PRT-00778) 2x5 Pin Shrouded Header <https://www.sparkfun.com/products/8506> (PRT-08506) On any of the 0.1 inch spaced packages, you can populate with these: Break Away Headers - Straight <https://www.sparkfun.com/products/116> (PRT-00116) Break Away Male Headers - Right Angle <https://www.sparkfun.com/products/553> (PRT-00553) Female Headers <https://www.sparkfun.com/products/115> (PRT-00115) Break Away Headers - Machine Pin <https://www.sparkfun.com/products/117> (PRT-00117) Break Away Female Headers - Swiss Machine Pin <https://www.sparkfun.com/products/743> (PRT-00743) Special note: the shrouded connector mates well with our 5x2 ribbon cables: 2x5 Pin IDC Ribbon Cable <https://www.sparkfun.com/products/8535> (PRT-08535); PROD_ID: CONN-08499; SF_ID: PRT-0778
J4 = SparkFun-Connectors:CONN_08X2: Multi connection point. Often used as Generic Header-pin footprint for 0.1 inch spaced/style header connections You can populate with any combo of single row headers, but if you'd like an exact match, check this: Header - 2x8 (Male, 0.1") <https://www.sparkfun.com/products/13156> (PRT-13156) On any of the 0.1 inch spaced packages, you can populate with these: Break Away Headers - Straight <https://www.sparkfun.com/products/116> (PRT-00116) Break Away Male Headers - Right Angle <https://www.sparkfun.com/products/553> (PRT-00553) Female Headers <https://www.sparkfun.com/products/115> (PRT-00115) Break Away Headers - Machine Pin <https://www.sparkfun.com/products/117> (PRT-00117) Break Away Female Headers - Swiss Machine Pin <https://www.sparkfun.com/products/743> (PRT-00743)
JP1 = SparkFun:JUMPER-2: Jumper Basic 0.1" spaced jumper. Use with breakaway headers.
L1 = tkrworks:L_: INDUCTOR
PWR = tkrworks:JST_2PIN: JST 2-Pin Connectors of various flavors SMT-RA (S2B-PH-SM4) 4UConnector #17311 SMT (B2B-PH-SM4) THM-RA (S2B-PH) THM (B2B-PH)
PWR_LED USER_LED0 USER_LED1 = tkrworks:LED; SPICEPREFIX: L
PWREN = SparkFun:M03: Header 3 Standard 3-pin 0.1" header. Use with straight break away headers (SKU : PRT-00116), right angle break away headers (PRT-00553), swiss pins (PRT-00743), machine pins (PRT-00117), and female headers (PRT-00115). Molex polarized connector foot print use with SKU : PRT-08232 with associated crimp pins and housings.
R1 R2 R4-R6 R11 R12 R16 R25-R31 R59 = tkrworks:RESISTOR: Resistor Basic schematic elements and footprints for 0603, 1206, and PTH resistors.; SPICEPREFIX: R
R3 R7-R10 R13-R15 R17-R20 R32-R54 R56-R58 = tkrworks:RESISTOR: Resistor Basic schematic elements and footprints for 0603, 1206, and PTH resistors.
X1 = tkrworks:EPSON_SG310
X2 X3 = tkrworks:2510-: 3M (TM) Pak 100 4-Wall Header Source: 3M